# Altium schematic sheet Sheet1.SchDoc
size A4; SheetNumber: 1; SheetTotal: 1
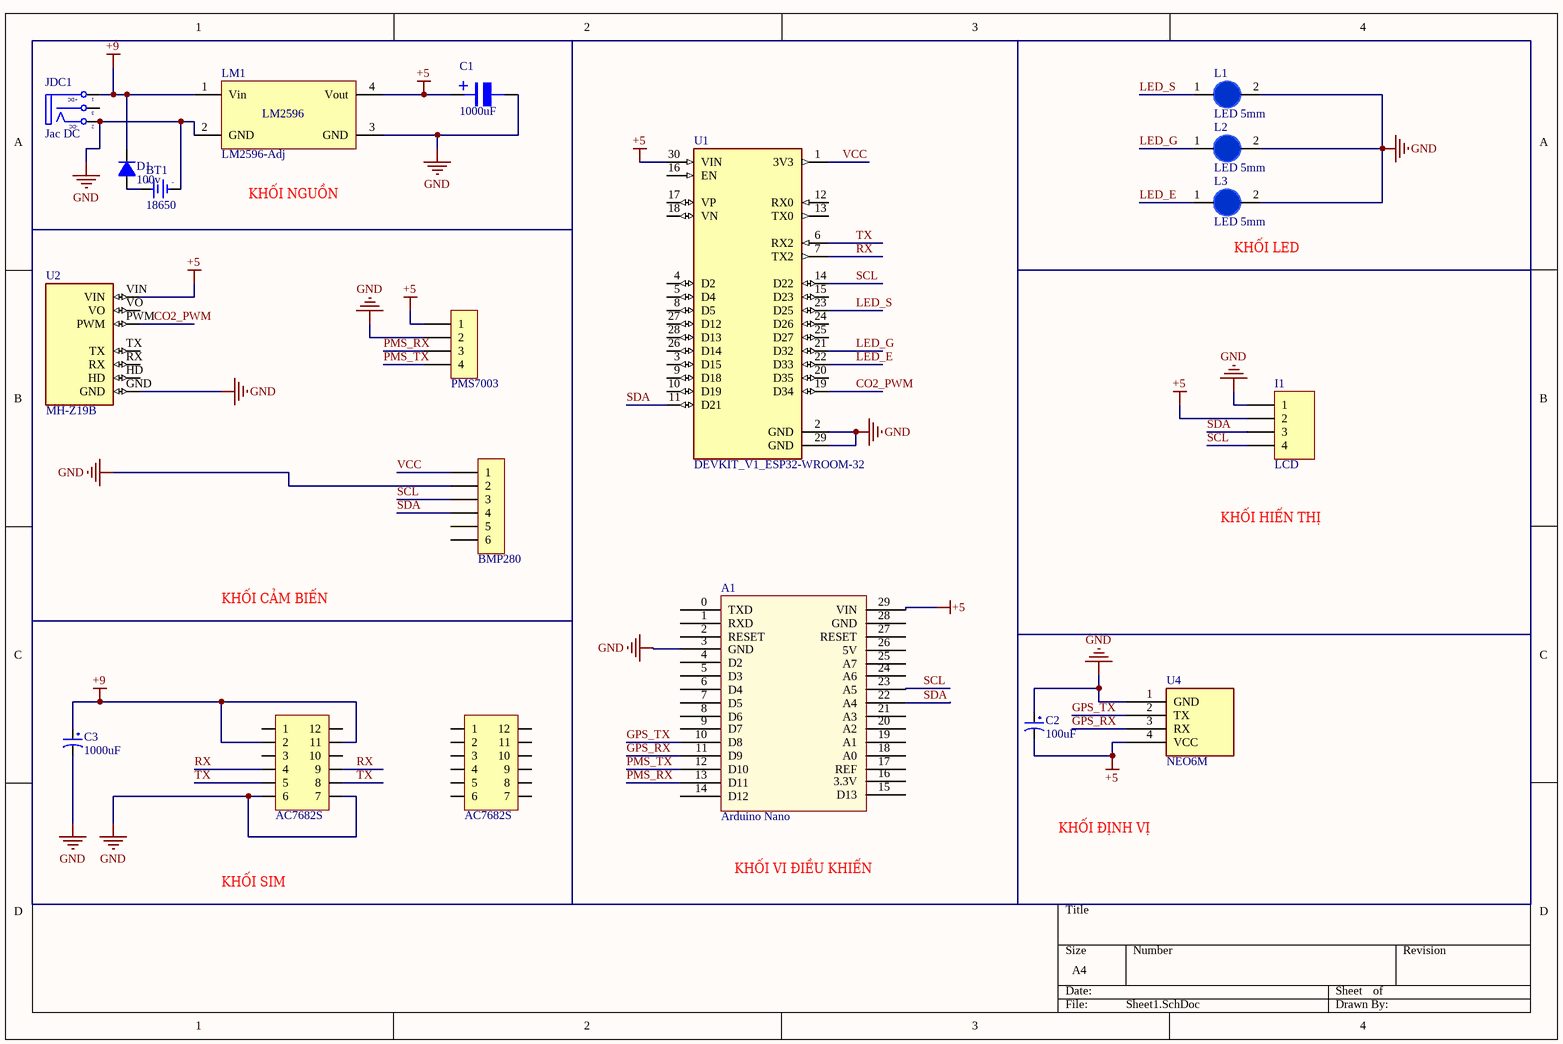
[diagram p0: Sheet1.SchDoc]

## Parts
A1  Arduino Nano  [Arduino Nano]
BT1  18650  [DE PIN 18650 X2]
C1  1000uF  [tu nhom 10 (G)]
C2  100uF  [tu hoa 5mm]
C3  1000uF  [tu hoa 13mm]
D1  100v  [DIODE 1A]
H1  PMS7003  [XH2.54M-4]
H2  BMP280  [Header 6P DC 2.54]
I1  LCD  [HEADER 4]
JDC1  Jac DC  [DC-IN]
JP1  AC7682S  [JP 2x6 CT]
JP2  AC7682S  [JP 2x6 CT]
L1  LED 5mm  [LED-5MM-BLUE]
L2  LED 5mm  [LED-5MM-BLUE]
L3  LED 5mm  [LED-5MM-BLUE]
LM1  LM2596-Adj  [lm2596]
U1  DEVKIT_V1_ESP32-WROOM-32  [MODULE_DEVKIT_V1_ESP32-WROOM-32]
U2  MH-Z19B  [MH-Z19B]
U4  NEO6M  [NEO6M]

## Nets
+5: A1.29(VIN) C1.1 C2.2 H1.1 I1.2 LM1.4(Vout) U1.30(VIN) U2.VIN U4.4(VCC)
+9: C3.1 D1.2(K) JDC1.1(T) JP2.2 JP2.11 LM1.1(Vin)
GND: A1.3(GND) BT1.2(GND) C1.2 C2.1 C3.2 H1.2 H2.2 I1.1 JDC1.2(TN) JP2.6 JP2.7 L1.2(K) L2.2(K) L3.2(K) LM1.2(GND) LM1.3(GND) U1.2(GND) U1.29(GND) U2.GND U4.1(GND)
CO2_PWM: U1.19(D34) U2.PWM
GPS_RX: A1.11(D9) U4.3(RX)
GPS_TX: A1.10(D8) U4.2(TX)
LED_E: L3.1(A) U1.22(D33)
LED_G: L2.1(A) U1.21(D32)
LED_S: L1.1(A) U1.23(D25)
PMS_RX: A1.13(D11) H1.3
PMS_TX: A1.12(D10) H1.4
RX: JP2.4 JP2.9 U1.7(TX2)
SCL: A1.23(A5) H2.3 I1.4 U1.14(D22)
SDA: A1.22(A4) H2.4 I1.3 U1.11(D21)
TX: JP2.5 JP2.8 U1.6(RX2)
VCC: H2.1 U1.1(3V3)
NetBT1_1: BT1.1(+3V) D1.1(A)

Not connected (* = marked no-connect by the designer): A1 0(TXD) 1(RXD) 2(RESET) 4(D2) 5(D3) 6(D4) 7(D5) 8(D6) 9(D7) 14(D12) 15(D13) 16(3.3V) 17(REF) 18(A0) 19(A1) 20(A2) 21(A3) 24(A6) 25(A7) 26(5V) 27(RESET) 28(GND); H2 5 6; JDC1 3(S); JP1 1 2 3 4 5 6 7 8 9 10 11 12; JP2 1 3 10 12; U1 3(D15) 4(D2) 5(D4) 8(D5) 9(D18) 10(D19) 12(RX0) 13(TX0) 15(D23) 16(EN) 17(VP) 18(VN) 20(D35) 24(D26) 25(D27) 26(D14) 27(D12) 28(D13); U2 HD RX TX VO

## Notes on the sheet
- KHỐI NGUỒN
- (near L3) KHỐI LED
- KHỐI HIỂN THỊ
- KHỐI CẢM BIẾN
- KHỐI ĐỊNH VỊ
- KHỐI SIM
- KHỐI VI ĐIỀU KHIỂN
- (in symbol DCIN) +DC; -DC
- (in symbol De Pin 18650 x2) +; -
- (in symbol LM2596-Adj) LM2596
- (in symbol Tu Nhom 1000uF 16V) +

## Library data of the parts
BT1 = De Pin 18650 x2: Ten: Hộp Đế Pin 18650 Hàn Mạch DP 18650-HM-02; Ma_Hang: MH010812
C1 = Tu Nhom 1000uF 16V: Dán; Don_Vi: Con; So_Chan: 2; Ten_Linh_Kien: Tụ Nhôm 1000uF 16V 10x10MM; Ma_Hang: MH004419; Chung_Loai: Dán; Kieu_Chan: *
C2 = Tu Hoa 100uF 16V 5x11: Cắm; Don_Vi: Con; So_Chan: 2; Ten_Linh_Kien: Tụ Hóa 100uF 16V 5x11MM; Ma_Hang: MH008417; Chung_Loai: Cắm; Kieu_Chan: *
C3 = Tu Hoa 1000uF 25V 13x21: Cắm; Don_Vi: Con; So_Chan: 2; Ten_Linh_Kien: Tụ Hóa 1000uF 25V 13x21MM; Ma_Hang: MH002315; Chung_Loai: Cắm; Kieu_Chan: *
D1 = Diode 1N4007: Cắm; Ten_Linh_Kien: Diode 1N4007 1A (DIP); Don_Vi: Con; Ma_Hang: MH001063; Ghi Chu: *; Kieu_Chan: *; Chung_Loai: Cắm
H1 = Header 4P 2.54 Duc Thang: Cắm; Ten_Linh_Kien: Header 4P XH2.54-4P Đực Thẳng; Don_Vi: Con; Ma_Hang: MH001285; Chung_Loai: Cắm
H2 = Header 6P 2.54 Duc Cong: Cắm; Ten_Linh_Kien: Header 6P XH2.54-6P Đực Cong; Don_Vi: Con; Ma_Hang: MH003363; Chung_Loai: Cắm
I1 = HEADER 4
JDC1 = DCIN: Jac DC input; Value: Jac DC
JP1 JP2 = JP 2x6 2.54 Cai Thang: Cắm; Ten_Linh_Kien: Jump Đôi Cái 2.54MM 2x20P Thẳng; Don_Vi: Con; Ma_Hang: MH008647; Ghi_Chu: *; Kieu_Chan: *; Chung_Loai: Cắm
L1-L3 = LED 5mm Xanh Duong: Cắm; Don_Vi: Con; Ma_Hang: MH008987; Ten_Linh_Kien: Led 5MM Xanh Dương Đục (1000c); Ghi_Chu: *; Kieu_Chan: *; Chung_Loai: Cắm
LM1 = LM2596-Adj: Designed By @Alixahedi
U1 = DEVKIT_V1_ESP32-WROOM-32: WROOM-32 Development Board ESP32 ESP-32S WiFi Bluetooth Dev Module; MF: Do it; MP: DEVKIT V1 ESP32-WROOM-32; SnapEDA_Link: https://www.snapeda.com/parts/DEVKIT%20V1%20ESP32-WROOM-32/Do+it/view-part/?ref=snap; Package: Package; Value: *; Check_prices: https://www.snapeda.com/parts/DEVKIT%20V1%20ESP32-WROOM-32/Do+it/view-part/?ref=eda
U2 = MH-Z19B: Intelligent Infrared CO2 Module; MF: Winsen; SnapEDA_Link: https://www.snapeda.com/parts/MH-Z19B/Winsen/view-part/?ref=snap; Package: Package; Value: *; MP: MH-Z19B; Check_prices: https://www.snapeda.com/parts/MH-Z19B/Winsen/view-part/?ref=eda